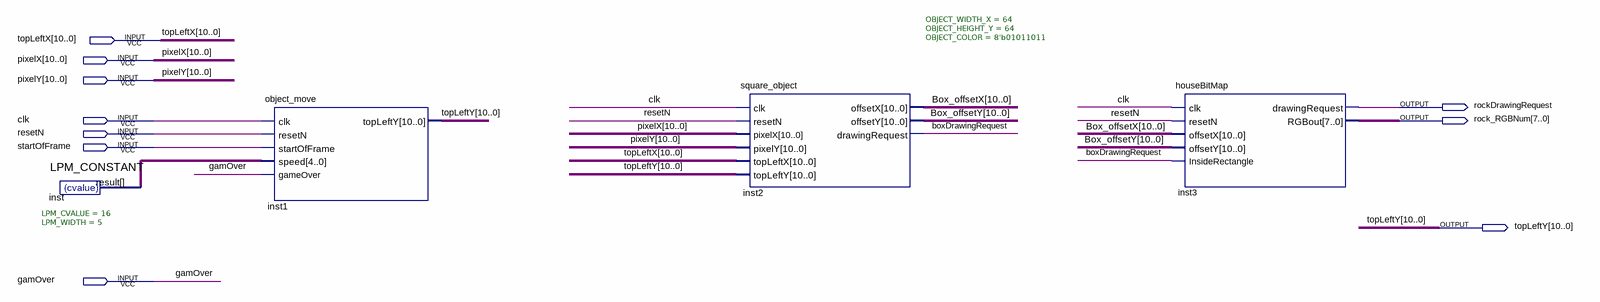
[diagram p0: schematic sheet]
// Quartus schematic House_Block.bdf as structural Verilog: 4 symbols, 10 pins
module House_Block (
  input  [10:0] topLeftX,
  input  [10:0] pixelX,
  input  [10:0] pixelY,
  input  clk,
  input  resetN,
  input  startOfFrame,
  input  gamOver,
  output rockDrawingRequest,
  output [7:0] rock_RGBNum,
  output [10:0] topLeftY
);

  wire boxDrawingRequest;
  wire [4:0] inst_result;
  wire [10:0] Box_offsetX, Box_offsetY;

  LPM_CONSTANT #(.LPM_CVALUE(16), .LPM_WIDTH(5)) inst (.result(inst_result));
  object_move inst1 (
    .clk(clk), .resetN(resetN), .startOfFrame(startOfFrame), .speed(inst_result), .gameOver(gamOver),
    .topLeftY(topLeftY));
  square_object #(.OBJECT_WIDTH_X(64), .OBJECT_HEIGHT_Y(64), .OBJECT_COLOR(8'b01011011)) inst2 (
    .clk(clk), .resetN(resetN), .pixelX(pixelX), .pixelY(pixelY), .topLeftX(topLeftX), .topLeftY(topLeftY),
    .offsetX(Box_offsetX), .offsetY(Box_offsetY), .drawingRequest(boxDrawingRequest));
  houseBitMap inst3 (
    .clk(clk), .resetN(resetN), .offsetX(Box_offsetX), .offsetY(Box_offsetY),
    .InsideRectangle(boxDrawingRequest), .drawingRequest(rockDrawingRequest), .RGBout(rock_RGBNum));
endmodule
